# EAGLE design os20.newenc (EAGLE 6.4)
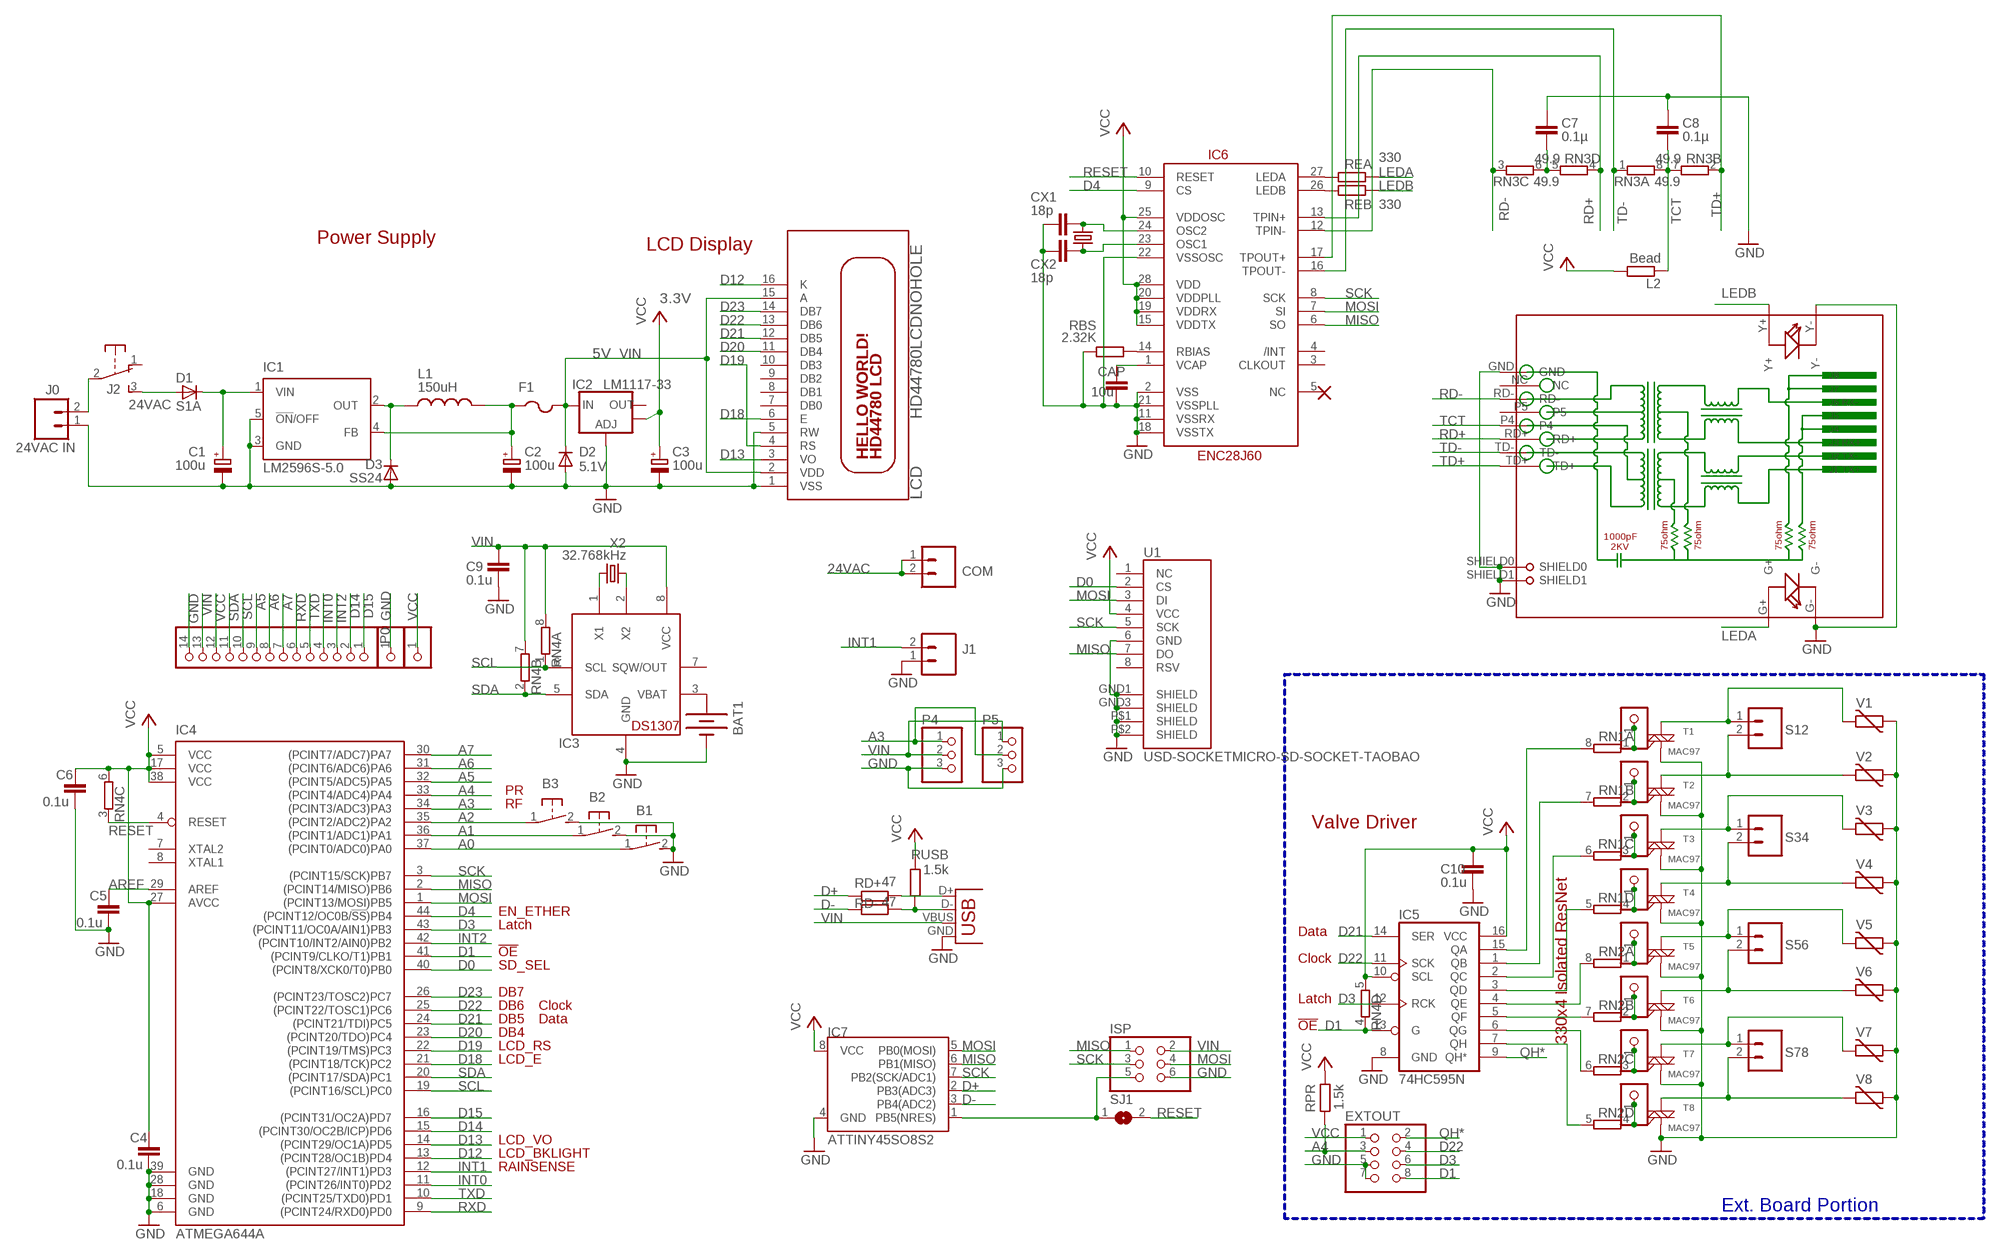
[diagram p0: schematic, sheet 1]

## Parts
B1  31-XX  [B3F-31XX]
B2  31-XX  [B3F-31XX]
B3  31-XX  [B3F-31XX]
BAT1  BATTERYBATTERY_12MM_SMT  [BATTCON_12MM_SMT]
C1  100u  CPOL-EUE3.5-8  [E3,5-8]
C2  100u  CPOL-EUD  [PANASONIC_D]
C3  100u  CPOL-EUD  [PANASONIC_D]
C4  0.1u  C-EUC0805  [C0805]
C5  0.1u  C-EUC0805  [C0805]
C6  0.1u  C-EUC0805  [C0805]
C7  0.1µ  C-EUC0805  [C0805]
C8  0.1µ  C-EUC0805  [C0805]
C9  0.1u  C-EUC0805  [C0805]
C10  0.1u  C-EUC0805  [C0805]
CAP  10u  C-EUC0805  [C0805]
COM  M025MM  [SCREWTERMINAL-5MM-2]
CX1  18p  C-EUC0805  [C0805]
CX2  18p  C-EUC0805  [C0805]
D1  S1A  DIODE-DO-214AC  [DO-214AC]
D2  5.1V  DIODE-MINIMELF  [MINIMELF]
D3  SS24  DIODE-DO-214AC  [DO-214AC]
EXTOUT  PINHD-2X4  [2X04]
F1  PTCFUSE-1812  [1812]
IC1  LM2596S-5.0  LM2596S  [TO263-5]
IC2  LM1117-33  V_REG_LM1117SOT223  [SOT223]
IC3  DS1307  DS1307SOIC  [SO08]
IC4  ATMEGA644A  [TQFP44]
IC5  74HC595N  74LS595D  [SO16]
IC6  ENC28J60  ENC28J60SO28LONG  [SOIC28WLONG]
IC7  ATTINY45SO8S2  [SO8S2]
ISP  PINHD-2X3  [2X03]
J0  24VAC IN  M025MM  [SCREWTERMINAL-5MM-2]
J1  M025MM  [SCREWTERMINAL-5MM-2]
J2  EG1206  [EG1206]
JP2  PINHD-1X1CB  [1X01-CLEANBIG]
JP3  PINHD-1X1CB  [1X01-CLEANBIG]
JP4  PINHD-1X1CB  [1X01-CLEANBIG]
JP5  PINHD-1X1CB  [1X01-CLEANBIG]
JP6  PINHD-1X1CB  [1X01-CLEANBIG]
JP7  PINHD-1X1CB  [1X01-CLEANBIG]
JP8  PINHD-1X1CB  [1X01-CLEANBIG]
JP9  PINHD-1X1CB  [1X01-CLEANBIG]
L1  150uH  INDUCTORPWR  [CDRH125]
L2  Bead  R-EU_R0805  [R0805]
LCD  HD44780LCDNOHOLE  [LCD1602A]
P0  PINHD-1X14-CB  [1X14-CB]
P1  PINHD-1X1CB  [1X01-CLEANBIG]
P2  PINHD-1X1CB  [1X01-CLEANBIG]
P4  PINHD-1X3  [1X03]
P5  PINHD-1X3  [1X03]
RBS  2.32K  R-EU_R0805  [R0805]
RD+  47  R-EU_R0805  [R0805]
RD-  47  R-EU_R0805  [R0805]
REA  330  R-EU_R0805  [R0805]
REB  330  R-EU_R0805  [R0805]
RJ45  HR911105A  [HR911105A]
RN1  4R-NEXB38V  [EXB38V]
RN2  4R-NEXB38V  [EXB38V]
RN3  49.9  4R-NEXB38V  [EXB38V]
RN4  4R-NEXB38V  [EXB38V]
RPR  1.5k  R-EU_R0805  [R0805]
RUSB  1.5k  R-EU_R0805  [R0805]
S12  M025MM  [SCREWTERMINAL-5MM-2]
S34  M025MM  [SCREWTERMINAL-5MM-2]
S56  M025MM  [SCREWTERMINAL-5MM-2]
S78  M025MM  [SCREWTERMINAL-5MM-2]
SJ1  SJ  [SJ]
T1  MAC97  MAC97SOT223  [SOT223]
T2  MAC97  MAC97SOT223  [SOT223]
T3  MAC97  MAC97SOT223  [SOT223]
T4  MAC97  MAC97SOT223  [SOT223]
T5  MAC97  MAC97SOT223  [SOT223]
T6  MAC97  MAC97SOT223  [SOT223]
T7  MAC97  MAC97SOT223  [SOT223]
T8  MAC97  MAC97SOT223  [SOT223]
U1  USD-SOCKETMICRO-SD-SOCKET-TAOBAO  [MICRO-SD-SOCKET-TAOBAO]
USB  USBPTH  [USB-B-PTH]
V1  MOV  VARISTOR-5  [R-5]
V2  MOV  VARISTOR-5  [R-5]
V3  MOV  VARISTOR-5  [R-5]
V4  MOV  VARISTOR-5  [R-5]
V5  MOV  VARISTOR-5  [R-5]
V6  MOV  VARISTOR-5  [R-5]
V7  MOV  VARISTOR-5  [R-5]
V8  MOV  VARISTOR-5  [R-5]
X1  25MHz  CRYSTALHC49US  [HC49US]
X2  32.768kHz  CRYSTALTC26H  [TC26H]

## Nets
24VAC [power]: COM.1 COM.2 D1.A J2.3(S)
A0: B1.1(P) IC4.37((PCINT0/ADC0)PA0)
A1: B2.1(P) IC4.36((PCINT1/ADC1)PA1)
A2: B3.1(P) IC4.35((PCINT2/ADC2)PA2)
A3: IC4.34((PCINT3/ADC3)PA3) P4.1 P5.2
A4: EXTOUT.3 IC4.33((PCINT4/ADC4)PA4) RPR.1
A5: IC4.32((PCINT5/ADC5)PA5) P0.9
A6: IC4.31((PCINT6/ADC6)PA6) P0.8
A7: IC4.30((PCINT7/ADC7)PA7) P0.7
AREF: C5.1 IC4.29(AREF)
D0: IC4.40((PCINT8/XCK0/T0)PB0) U1.2(CS)
D1: EXTOUT.8 IC4.41((PCINT9/CLKO/T1)PB1) IC5.13(G) RN4.4
D3: EXTOUT.6 IC4.43((PCINT11/OC0A/AIN1)PB3) IC5.12(RCK)
D4: IC4.44((PCINT12/OC0B/!SS!)PB4) IC6.9(CS)
D12: IC4.13((PCINT28/OC1B)PD4) LCD.16(K)
D13: IC4.14((PCINT29/OC1A)PD5) LCD.3(VO)
D14: IC4.15((PCINT30/OC2B/ICP)PD6) P0.2
D15: IC4.16((PCINT31/OC2A)PD7) P0.1
D18: IC4.21((PCINT18/TCK)PC2) LCD.6(E)
D19: IC4.22((PCINT19/TMS)PC3) LCD.4(RS)
D20: IC4.23((PCINT20/TDO)PC4) LCD.11(DB4)
D21: IC4.24((PCINT21/TDI)PC5) IC5.14(SER) LCD.12(DB5)
D22: EXTOUT.4 IC4.25((PCINT22/TOSC1)PC6) IC5.11(SCK) LCD.13(DB6)
D23: IC4.26((PCINT23/TOSC2)PC7) LCD.14(DB7)
D+: IC7.2(PB3(ADC3)) RD+.1
D-: IC7.3(PB4(ADC2)) RD-.1
GND: B1.2(S) B2.2(S) B3.2(S) BAT1.P$1(-) C1.- C2.- C3.- C4.2 C5.2 C6.2 C7.1 C8.1 C9.2 C10.2 CAP.2 CX1.2 CX2.2 D2.A D3.A EXTOUT.5 EXTOUT.7 IC1.3(GND) IC1.5(!ON!/OFF) IC2.1(ADJ) IC3.4(GND) IC4.6(GND) IC4.18(GND) IC4.28(GND) IC4.39(GND) IC5.8(GND) IC6.2(VSS) IC6.11(VSSRX) IC6.18(VSSTX) IC6.21(VSSPLL) IC6.22(VSSOSC) IC7.4(GND) ISP.6 J0.1 J1.1 LCD.1(VSS) LCD.5(RW) P0.14 P1.1 P4.3 P5.3 RBS.1 RJ45.G- RJ45.GND RJ45.SHIELD0 RJ45.SHIELD1 RJ45.Y- T1.1(M1) T2.1(M1) T3.1(M1) T4.1(M1) T5.1(M1) T6.1(M1) T7.1(M1) T8.1(M1) U1.6(GND) U1.GND1(SHIELD) U1.GND3(SHIELD) U1.P$1(SHIELD) U1.P$2(SHIELD) USB.GND V1.1 V2.1 V3.1 V4.1 V5.1 V6.1 V7.1 V8.1
INT0: IC4.11((PCINT26/INT0)PD2) P0.4
INT1: IC4.12((PCINT27/INT1)PD3) J1.2
INT2: IC4.42((PCINT10/INT2/AIN0)PB2) P0.3
LEDA: REA.2 RJ45.G+
LEDB: REB.2 RJ45.Y+
MISO: IC4.2((PCINT14/MISO)PB6) IC6.6(SO) IC7.6(PB1(MISO)) ISP.1 U1.7(DO)
MOSI: IC4.1((PCINT13/MOSI)PB5) IC6.7(SI) IC7.5(PB0(MOSI)) ISP.4 U1.3(DI)
N$1 [power]: C1.+ D1.C IC1.1(VIN)
N$2 [power]: C2.+ F1.1 IC1.4(FB) L1.2
N$3: JP2.1 RN1.1 T1.3(G)
N$4: IC5.5(QF) RN2.7
N$5: IC5.6(QG) RN2.6
N$6 [power]: J0.2 J2.2(P)
N$7: IC5.7(QH) RN2.5
N$8: IC3.1(X1) X2.2
N$9 [power]: D3.C IC1.2(OUT) L1.1
N$10: IC5.4(QE) RN2.8
N$11: IC5.3(QD) RN1.5
N$12: IC5.2(QC) RN1.6
N$13: IC5.1(QB) RN1.7
N$14: IC5.15(QA) RN1.8
N$15: JP3.1 RN1.2 T2.3(G)
N$16 [power]: S12.1 T1.4(M2) V1.2
N$17 [power]: S12.2 T2.4(M2) V2.2
N$18 [power]: S34.1 T3.4(M2) V3.2
N$19: JP4.1 RN1.3 T3.3(G)
N$20 [power]: S34.2 T4.4(M2) V4.2
N$21: JP5.1 RN1.4 T4.3(G)
N$22 [power]: S56.1 T5.4(M2) V5.2
N$23 [power]: S56.2 T6.4(M2) V6.2
N$24 [power]: S78.1 T7.4(M2) V7.2
N$25 [power]: S78.2 T8.4(M2) V8.2
N$26: JP6.1 RN2.1 T5.3(G)
N$27: JP7.1 RN2.2 T6.3(G)
N$28: JP8.1 RN2.3 T7.3(G)
N$29: JP9.1 RN2.4 T8.3(G)
N$30: IC3.2(X2) X2.1
N$34: IC6.27(LEDA) REA.1
N$36: BAT1.P$2(+) IC3.3(VBAT)
N$37: IC6.26(LEDB) REB.1
N$38: RD+.2 USB.D+
N$39: CAP.1 IC6.1(VCAP)
N$41: CX1.1 IC6.24(OSC2) X1.2
N$42: CX2.1 IC6.23(OSC1) X1.1
N$45: RD-.2 RUSB.1 USB.D-
N$52: IC7.1(PB5(NRES)) ISP.5 SJ1.1
N$54: C7.2 RN3.5 RN3.6
N$59: IC6.14(RBIAS) RBS.2
QH*: EXTOUT.2 IC5.9(QH*)
RD+: IC6.13(TPIN+) RJ45.RD+ RN3.4
RD-: IC6.12(TPIN-) RJ45.RD- RN3.3
RESET: IC4.4(RESET) IC6.10(RESET) RN4.3 SJ1.2
RXD: IC4.9((PCINT24/RXD0)PD0) P0.6
SCK: IC4.3((PCINT15/SCK)PB7) IC6.8(SCK) IC7.7(PB2(SCK/ADC1)) ISP.3 U1.5(SCK)
SCL: IC3.6(SCL) IC4.19((PCINT16/SCL)PC0) P0.10 RN4.1
SDA: IC3.5(SDA) IC4.20((PCINT17/SDA)PC1) P0.11 RN4.2
TCT: C8.2 L2.1 RJ45.P4 RN3.7 RN3.8
TD+: IC6.17(TPOUT+) RJ45.TD+ RN3.2
TD-: IC6.16(TPOUT-) RJ45.TD- RN3.1
TXD: IC4.10((PCINT25/TXD0)PD1) P0.5
VCC: C3.+ C4.1 C6.1 C10.1 EXTOUT.1 IC2.4(OUT) IC4.5(VCC) IC4.17(VCC) IC4.27(AVCC) IC4.38(VCC) IC5.10(SCL) IC5.16(VCC) IC6.15(VDDTX) IC6.19(VDDRX) IC6.20(VDDPLL) IC6.25(VDDOSC) IC6.28(VDD) IC7.8(VCC) L2.2 P0.12 P2.1 RN4.5 RN4.6 RPR.2 RUSB.2 U1.4(VCC)
VIN [power]: C9.1 D2.C F1.2 IC2.3(IN) IC3.8(VCC) ISP.2 LCD.2(VDD) LCD.15(A) P0.13 P4.2 P5.1 RN4.7 RN4.8 USB.VBUS
Unconnected: IC2.2(OUT) IC3.7(SQW/OUT) IC4.7(XTAL2) IC4.8(XTAL1) IC6.3(CLKOUT) IC6.4(/INT) IC6.5(NC) J2.1(O) LCD.7(DB0) LCD.8(DB1) LCD.9(DB2) LCD.10(DB3) RJ45.NC RJ45.P5 U1.1(NC) U1.8(RSV)

## Buses
B$1

## Notes on the sheet
- Power Supply
- LCD Display
- 3.3V
- 5V
- PR
- RF
- Valve Driver
- EN_ETHER
- Latch
- Data
- !OE
- Clock
- SD_SEL
- DB7
- Latch
- DB6 | Clock
- DB5 | Data
- !OE
- DB4
- 330x4 Isolated ResNet
- LCD_RS
- LCD_E
- LCD_VO
- LCD_BKLIGHT
- RAINSENSE
- Ext. Board Portion

## Library data of the parts
B1-B3 = adafruit:31-XX: OMRON SWITCH Now with beefier pads!
BAT1 = SparkFunNew:BATTERY: Battery Holders Various common sizes : AA, AAA, 20mm coin cell and 12mm coin cell.
C1-C3 = resistor:CPOL-EU: POLARIZED CAPACITOR, European symbol
C4-C6 C9 C10 = rcl:C-EU: CAPACITOR, European symbol
C7 C8 CAP CX1 CX2 = resistor:C-EU: CAPACITOR, European symbol
COM J0 J1 S12 S34 S56 S78 = SparkFun:M02: Header 2 Standard 2-pin 0.1" header. Use with straight break away headers (SKU : PRT-00116), right angle break away headers (PRT-00553), swiss pins (PRT-00743), machine pins (PRT-00117), and female headers (PRT-00115). Molex polarized connector foot print use with SKU : PRT-08233 with associated crimp pins and housings.
D1-D3 = diode:DIODE-: DIODE
EXTOUT = pinhead:PINHD-2X4: PIN HEADER
F1 = adafruit:PTCFUSE: PTC fuses, resettable thermistors
IC1 = national-semiconductor:LM2596: SIMPLE SWITCHER® Power Converter 150 kHz 3A Step-Down Voltage Regulator Source: http://www.national.com/ds/LM/LM2596.pdf; MF: NATIONAL SEMICONDUCTOR; MPN: LM2596S-ADJ/NOPB; OC_FARNELL: 9494367; OC_NEWARK: 41K3842
IC2 = SparkFun:V_REG_LM1117: Voltage Regulator LM1117 Standard adjustable voltage regulator but in SMD form. Spark Fun Electronics SKU : COM-00595
IC3 = adafruit:DS1307: DS1307 Real time clock (RTC) with battery backup ability. Talk to it via i2c
IC4 = atmel:ATMEGA644: 8-bit Microcontroller with 64K Bytes In-System Programmable Flash Source: http://www.atmel.com/dyn/resources/prod_documents/doc2593.pdf; MPN: ATMEGA644PV-10AU; OC_FARNELL: 1455123; OC_NEWARK: 58M3748
IC5 = SparkFun:74*595: 8-bit SHIFT REGISTER, output latch
IC6 = SparkFun:ENC28J60
IC7 = SparkFun:ATTINY45: Atmel ATTiny45
ISP = pinhead:PINHD-2X3: PIN HEADER
J2 = adafruit:EG1206
JP2-JP9 P1 P2 = adafruit:PINHD-1X1: Pin header 1x1 for 0.1" spacing With round pins
L1 = SparkFunNew:INDUCTOR: Inductors Basic Inductor/Choke - 0603 and 1206. Footprints are not proven and vary greatly between part numbers.
L2 RBS RD+ RD- REA REB RPR RUSB = rcl:R-EU_: RESISTOR, European symbol
LCD = adafruit:HD44780LCD: HD44780 LCD Standard character type LCDs, available in sizes from 8x1 to 40x4!
P0 = adafruit:PINHD-1X14: PIN HEADER
P4 P5 = pinhead:PINHD-1X3: PIN HEADER
RJ45 = CONNECTER:HR911105A
RN1-RN4 = resistor-dil:4R-N: Array Chip Resistor Source: RS Component / Phycomp; OC_FARNELL: unknown; OC_NEWARK: unknown
SJ1 = jumper:SJ: SMD solder JUMPER
T1-T8 = SparkFun:MAC97: MAC97 Triac http://www.onsemi.com/pub_link/Collateral/MAC97-D.PDF
U1 = SparkFunNew:USD-SOCKET: microSD Socket Push-push type uSD socket. Schematic element and footprint production proven. Spark Fun Electronics SKU : PRT-00127. tDoc lines correctly indicate media card edge positions when inserting (unlocked, locked, depressed).
USB = SparkFunNew:USB: USB Connectors USB-B-PTH is fully proven SKU : PRT-00139 USB-miniB is fully proven SKU : PRT-00587 USB-A-PCB is untested. USB-A-H is throughly reviewed, but untested. Spark Fun Electronics SKU : PRT-00437 USB-B-SMT is throughly reviewed, but untested. Needs silkscreen touching up. USB-A-S has not been used/tested USB-MB-H has not been used/tested
V1-V8 = varistor:VARISTOR: VARISTOR
X1 = SparkFun:CRYSTAL: Crystals Various standard crystals. Proven footprints. Spark Fun Electronics SKU : COM-00534
X2 = crystal:CRYSTAL: CRYSTAL; OC_FARNELL: unknown; OC_NEWARK: unknown

## Net classes
0 default: width 0.305 mm, clearance 0.203 mm
1 power: width 0.61 mm, clearance 0.203 mm

## Board
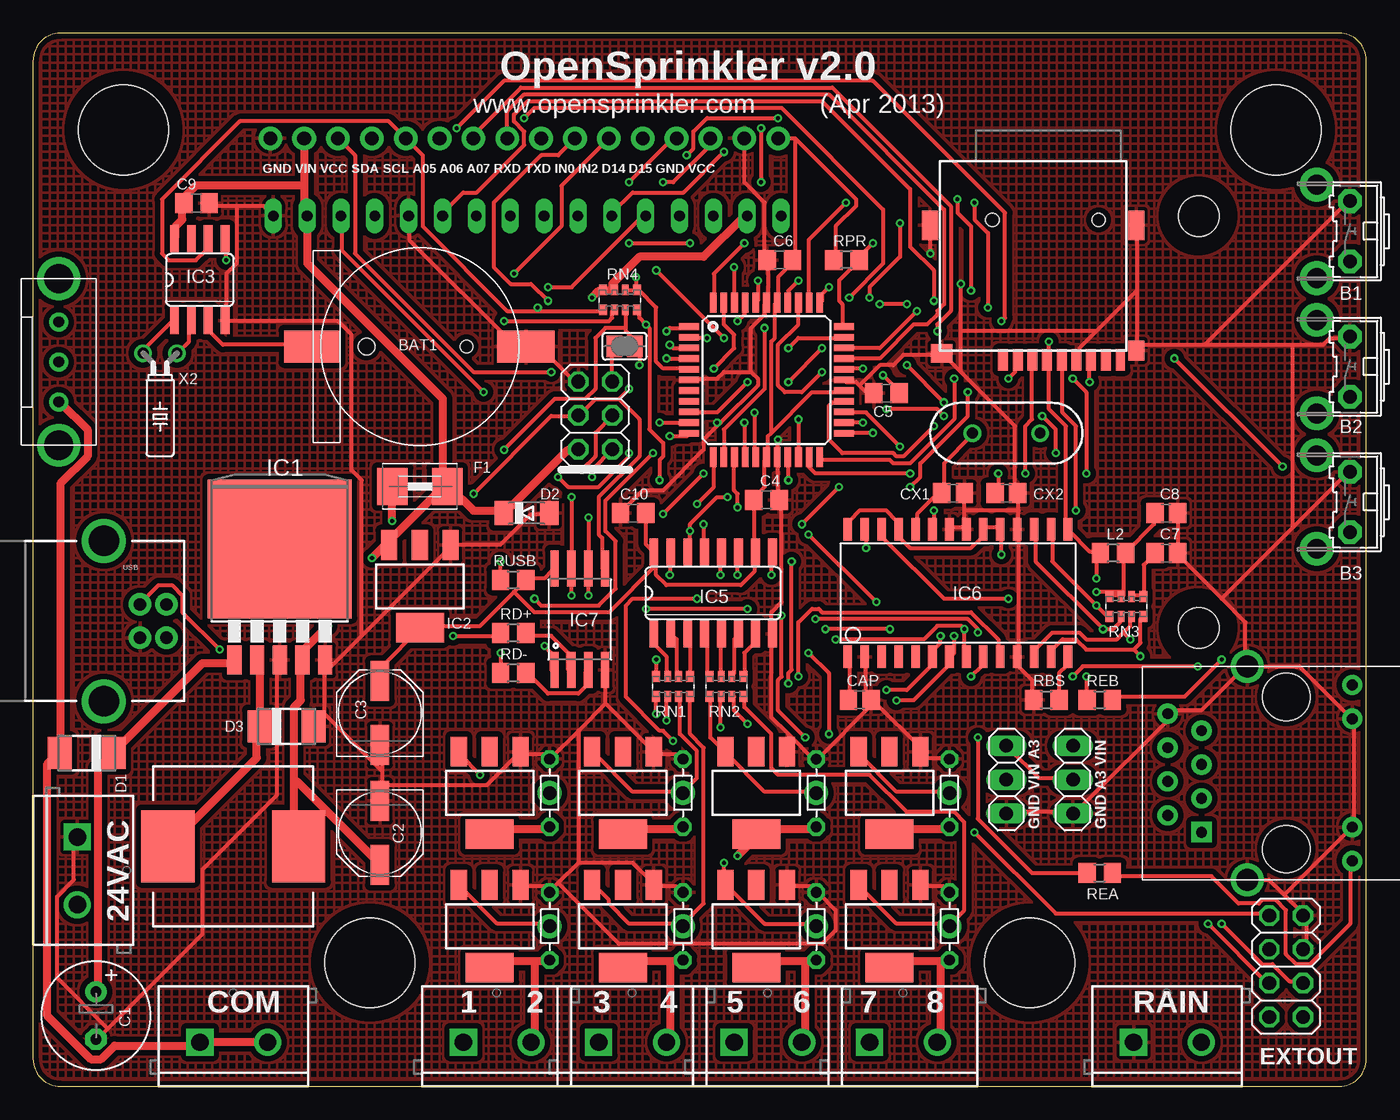
[diagram p1: board, top side]
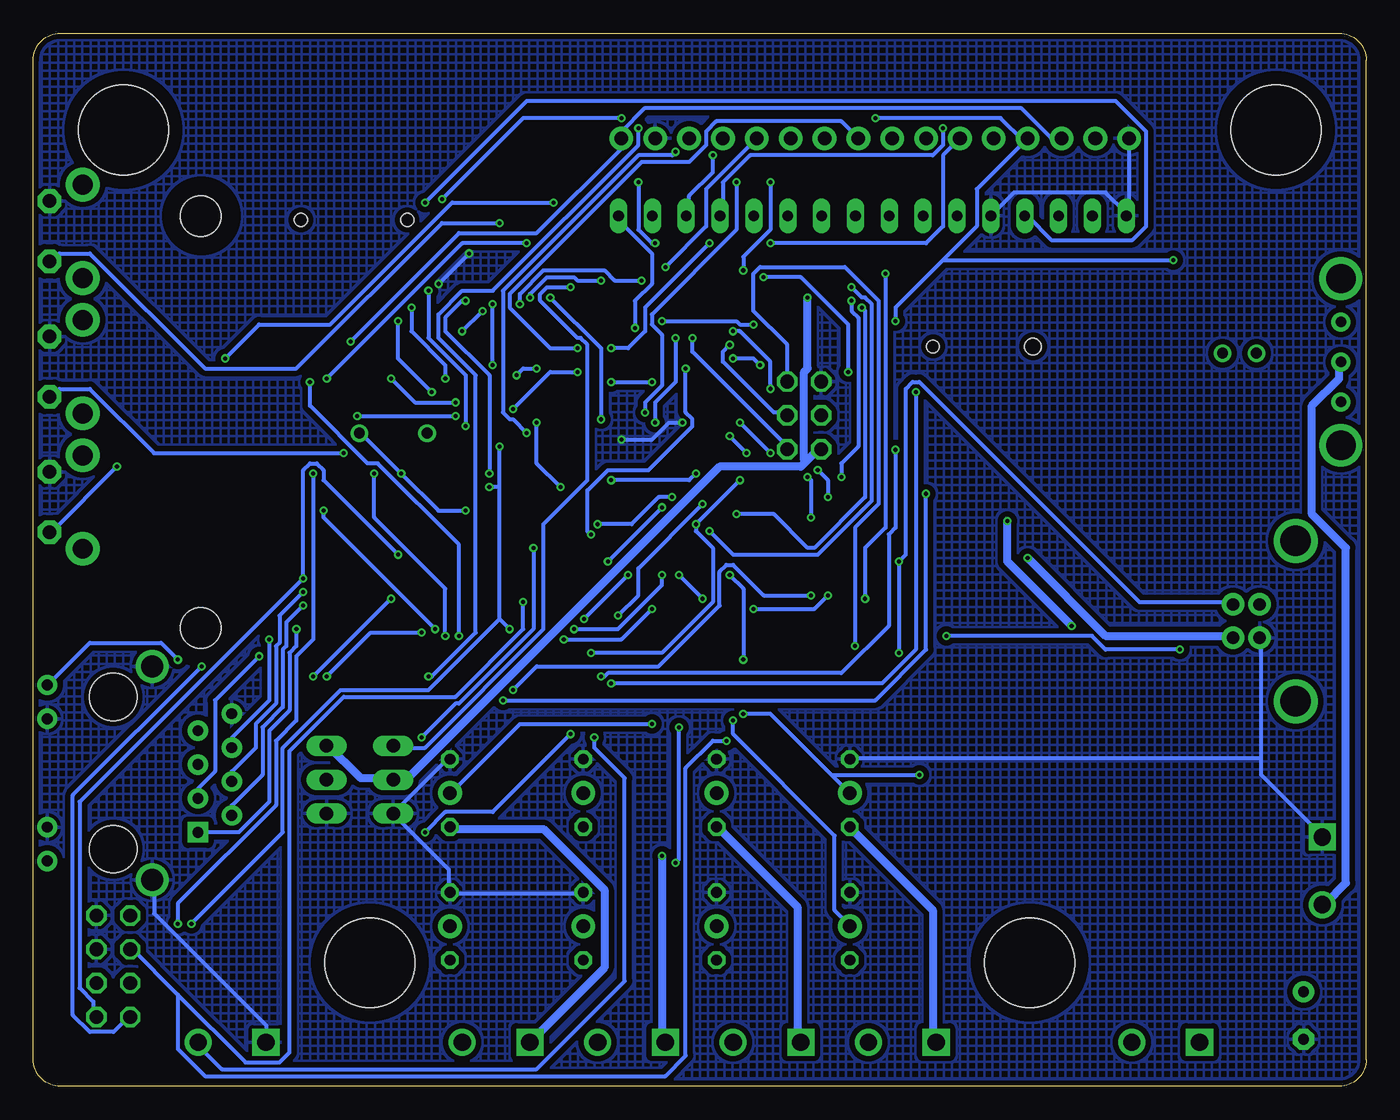
[diagram p2: board, bottom side, seen from below]

Size 100 x 79 mm. Coordinates in mm from the lower left corner, seen from the top.
Outline: 98,79 2,79 arc90 0,77 0,2 arc90 2,0 98,0 arc90 100,2 100,77 arc90 98,79
Copper layers (1*16): Top 0.035mm / dielectric 1.5mm / Bottom 0.035mm
Design rules "Fusion_eagle_rule_v1.1": minimum track width 6mil, minimum drill 12mil, track to track 6mil, track to pad 6mil, pad to pad 6mil, via to via 6mil, smd to smd 0mil, copper to edge 10mil, drill to drill 10mil, minimum pad ring 10mil, minimum via ring 6mil, stop-mask expansion 2mil, vias tented up to drill 100mil, thermal gap 10mil
Holes 3.05 mm at 87.46,65.3 87.46,34.38
Holes 6.75 mm at 6.76,71.74 93.24,71.74 25.26,9.26 74.74,9.26
tRestrict: area 84.9,31.8 to 89.9,36.9; area 84.9,62.8 to 89.9,67.8; area 2.8,67.7 to 10.8,75.7; area 89.2,67.7 to 97.2,75.7; area 21.3,5.3 to 29.3,13.3; area 70.7,5.3 to 78.7,13.3
bRestrict: area 2.8,67.7 to 10.8,75.7; area 89.2,67.7 to 97.2,75.7; area 21.3,5.3 to 29.3,13.3; area 70.7,5.3 to 78.7,13.3; area 84.9,62.8 to 89.9,67.8; area 84.9,31.8 to 89.9,36.9
vRestrict: area 32,73 to 71,78; area 17.3,68.3 to 57.1,69.3

### Footprints (pad centres in the part's own frame; a part is rotated, then mirrored left to right if it is on the bottom)
B3F-31XX = drill 1.016 pad 1.778 octagon: 1 -2.261,-1.245; 2 2.261,-1.245 | drill 1.499 pad 2.54: 3 -3.505,1.245; 4 3.505,1.245
BATTCON_12MM_SMT = smd 2.4 x 4.3: P$1 0,11.96 | smd 2.4 x 4.2: P$2 0,-4.1 | hole 0.95: 0,7.5 | hole 1.25: 0,0
E3,5-8 = drill 0.813 pad 1.6: + -1.778,0 | drill 0.813 pad 1.6 octagon: - 1.778,0
PANASONIC_D = smd 3 x 1.4: + 2.4,0; - -2.4,0
C0805 = smd 1.3 x 1.5: 1 -0.95,0; 2 0.95,0
C0805' = smd 1.3 x 1.5: 1 -0.85,0; 2 0.85,0
SCREWTERMINAL-5MM-2 = drill 1.3 pad 2.032 square: 1 0,0 | drill 1.3 pad 2.032: 2 5.08,0
DO-214AC = smd 1.8 x 2.4: A 2.025,0; C -2.025,0
MINIMELF = smd 1.4 x 1.8: A 1.7,0; C -1.7,0
2X04 = drill 1.016 octagon: 1 -3.81,-1.27; 2 -3.81,1.27; 3 -1.27,-1.27; 4 -1.27,1.27; 5 1.27,-1.27; 6 1.27,1.27; 7 3.81,-1.27; 8 3.81,1.27
1812 = smd 2.286 x 2.794: 1 -2.046,0; 2 2.046,0
TO263-5 = smd 1.067 x 2.159: 1 -3.404,-5.791; 2 -1.702,-5.791; 3 0,-5.791; 4 1.702,-5.791; 5 3.404,-5.791 | smd 10.8 x 10.41: 6 0,2.54
SOT223 = smd 1.219 x 2.235: 1 -2.311,-3.099; 2 0,-3.099; 3 2.311,-3.099 | smd 3.6 x 2.2: 4 0,3.099
SO08 = smd 0.66 x 2.032: 1 -1.905,-3.073; 2 -0.635,-3.073; 3 0.635,-3.073; 4 1.905,-3.073; 5 1.905,3.073; 6 0.635,3.073; 7 -0.635,3.073; 8 -1.905,3.073
TQFP44 = smd 1.5 x 0.5: 1 -5.8,4; 2 -5.8,3.2; 3 -5.8,2.4; 4 -5.8,1.6; 5 -5.8,0.8; 6 -5.8,0; 7 -5.8,-0.8; 8 -5.8,-1.6; 9 -5.8,-2.4; 10 -5.8,-3.2; 11 -5.8,-4; 23 5.8,-4; 24 5.8,-3.2; 25 5.8,-2.4; 26 5.8,-1.6; 27 5.8,-0.8; 28 5.8,0; 29 5.8,0.8; 30 5.8,1.6; 31 5.8,2.4; 32 5.8,3.2; 33 5.8,4 | smd 0.5 x 1.5: 12 -4,-5.8; 13 -3.2,-5.8; 14 -2.4,-5.8; 15 -1.6,-5.8; 16 -0.8,-5.8; 17 0,-5.8; 18 0.8,-5.8; 19 1.6,-5.8; 20 2.4,-5.8; 21 3.2,-5.8; 22 4,-5.8; 34 4,5.8; 35 3.2,5.8; 36 2.4,5.8; 37 1.6,5.8; 38 0.8,5.8; 39 0,5.8; 40 -0.8,5.8; 41 -1.6,5.8; 42 -2.4,5.8; 43 -3.2,5.8; 44 -4,5.8
SO16 = smd 0.66 x 2.032: 1 -4.445,-3.073; 2 -3.175,-3.073; 3 -1.905,-3.073; 4 -0.635,-3.073; 5 0.635,-3.073; 6 1.905,-3.073; 7 3.175,-3.073; 8 4.445,-3.073; 9 4.445,3.073; 10 3.175,3.073; 11 1.905,3.073; 12 0.635,3.073; 13 -0.635,3.073; 14 -1.905,3.073; 15 -3.175,3.073; 16 -4.445,3.073
SOIC28WLONG = smd 0.65 x 1.7: 1 -8.89,-4.78; 2 -7.62,-4.78; 3 -6.35,-4.78; 4 -5.08,-4.78; 5 -3.81,-4.78; 6 -2.54,-4.78; 7 -1.27,-4.78; 8 0,-4.78; 9 1.27,-4.78; 10 2.54,-4.78; 11 3.81,-4.78; 12 5.08,-4.78; 13 6.35,-4.78; 14 7.62,-4.78; 15 7.62,4.78; 16 6.35,4.78; 17 5.08,4.78; 18 3.81,4.78; 19 2.54,4.78; 20 1.27,4.78; 21 0,4.78; 22 -1.27,4.78; 23 -2.54,4.78; 24 -3.81,4.78; 25 -5.08,4.78; 26 -6.35,4.78; 27 -7.62,4.78; 28 -8.89,4.78
SO8S2 = smd 0.61 x 2.7: 1 -1.905,-3.778; 2 -0.635,-3.778; 3 0.635,-3.778; 4 1.905,-3.778; 5 1.905,3.853; 6 0.635,3.853; 7 -0.635,3.853; 8 -1.905,3.853
2X03 = drill 1.016 octagon: 1 -2.54,-1.27; 2 -2.54,1.27; 3 0,-1.27; 4 0,1.27; 5 2.54,-1.27; 6 2.54,1.27
EG1206 = drill 0.8 pad 1.422: 1 -3,0; 2 0,0; 3 3,0 | drill 2.2: MT1 -6.25,0; MT2 6.25,0
1X01-CLEANBIG = drill 1.016 pad 1.778: 1 0,0
CDRH125 = smd 5.4 x 4: 1 0,4.9; 2 0,-4.9
R0805 = smd 1.3 x 1.5: 1 -0.95,0; 2 0.95,0
LCD1602A = drill 0.8 long: 1 8,33.46; 2 10.54,33.46; 3 13.08,33.46; 4 15.62,33.46; 5 18.16,33.46; 6 20.7,33.46; 7 23.24,33.46; 8 25.78,33.46; 9 28.32,33.46; 10 30.86,33.46; 11 33.4,33.46; 12 35.94,33.46; 13 38.48,33.46; 14 41.02,33.46; 15 43.56,33.46; 16 46.1,33.46
1X14-CB = drill 1.016 pad 1.778: 1 -16.51,0; 2 -13.97,0; 3 -11.43,0; 4 -8.89,0; 5 -6.35,0; 6 -3.81,0; 7 -1.27,0; 8 1.27,0; 9 3.81,0; 10 6.35,0; 11 8.89,0; 12 11.43,0; 13 13.97,0; 14 16.51,0
1X03 = drill 1.016 long: 1 -2.54,0; 2 0,0; 3 2.54,0
HR911105A = drill 0.813 pad 1.524: G+ 4.953,-6.604; G- 4.953,-4.064; GND -8.89,4.445; NC -6.35,3.175; P4 -8.89,-0.635; P5 -6.35,0.635; RD+ -6.35,-1.905; RD- -8.89,1.905; TD- -8.89,-3.175; Y+ 4.953,6.604; Y- 4.953,4.064 | drill 1.651 pad 2.159: SHIELD0 -2.921,8.001; SHIELD1 -2.921,-8.001 | drill 0.813 pad 1.524 square: TD+ -6.35,-4.445 | hole 3.556: 0,-5.715; 0,5.715
EXB38V = smd 0.6 x 0.8: 1 -1.275,-0.75; 4 1.275,-0.75; 5 1.275,0.75; 8 -1.275,0.75 | smd 0.5 x 0.8: 2 -0.4,-0.75; 3 0.4,-0.75; 6 0.4,0.75; 7 -0.4,0.75
SJ = smd 1.168 x 1.6: 1 -0.762,0; 2 0.762,0
MICRO-SD-SOCKET-TAOBAO = smd 0.75 x 1.6: 1 2.25,10.5; 2 1.15,10.5; 3 0.05,10.5; 4 -1.05,10.5; 5 -2.15,10.5; 6 -3.25,10.5; 7 -4.35,10.5; 8 -5.45,10.5 | smd 0.7 x 1.6: CD -6.55,10.5 | smd 1.2 x 1.5: GND1 -7.75,9.8 | smd 1.6 x 1.4: GND3 6.85,10 | smd 1.2 x 2.2: P$1 7.75,0.4; P$2 -7.75,0.4 | hole 1: 3.05,0; -4.93,0
USB-B-PTH = drill 0.914 pad 1.676: D+ 0,1.25; D- 1.981,1.25; GND 0,-1.25; VBUS 1.981,-1.25 | drill 2.286: S1 -2.718,-6.02; S2 -2.718,6.02
R-5 = drill 0.813 octagon: 1 -2.54,0; 2 2.54,0
HC49US = drill 0.813: 1 -2.54,0; 2 2.54,0
TC26H = drill 0.813: 1 -1.27,0; 2 1.27,0

### Placement (x,y rotation side)
B1  97.54,64.15 90 top
B2  97.54,53.99 90 top
B3  97.54,43.83 90 top
BAT1  25,55.5 270 top
C1  4.7,5.3 270 top
C2  26,19 270 top
C3  26,28 90 top
C4  55,44 0 top
C5  64,52 180 top
C6  56,62 180 top
C7  0.1µ  [C0805']  85,40 180 top
C8  0.1µ  [C0805']  85,43 180 top
C9  12.24,66.25 0 top
C10  45,43 180 top
CAP  10u  [C0805']  62,29 0 top
COM  12.5,3.3 0 top
CX1  18p  [C0805']  69,44.5 0 top
CX2  18p  [C0805']  73,44.5 0 top
D1  4,25 180 top
D2  37,43 0 top
D3  19,27 0 top
EXTOUT  94,9 90 top
F1  29,45 0 top
IC1  18.49,37.76 0 top
IC2  29,37.5 180 top
IC3  12.49,60.51 0 top
IC4  55,53 0 top
IC5  51,37 0 top
IC6  70,37 0 top
IC7  41,35 0 top
ISP  42.16,50.33 90 top
J0  3.3,18.7 270 top
J1  82.55,3.3 0 top
J2  1.9,54.34 270 top
JP2  38.74,22 0 top
JP3  38.74,12 0 top
JP4  48.74,22 0 top
JP5  48.74,12 0 top
JP6  58.74,22 0 top
JP7  58.74,12 0 top
JP8  68.74,22 0 top
JP9  68.74,12 0 top
L1  15,18 90 top
L2  81,40 180 top
LCD  10,31.84 0 top
P0  34.29,71.12 180 top
P1  53.34,71.12 0 top
P2  55.88,71.12 0 top
P4  73,23 270 top
P5  78,23 270 top
RBS  76,29 0 top
RD+  36,34 180 top
RD-  36,31 180 top
REA  80,16 0 top
REB  80,29 0 top
RJ45  94,23.5 0 top
RN1  48,30 0 top
RN2  52,30 0 top
RN3  82,36 0 top
RN4  44,59 0 top
RPR  61,62 180 top
RUSB  36,38 0 top
S12  32.26,3.3 0 top
S34  42.42,3.3 0 top
S56  52.58,3.3 0 top
S78  62.74,3.3 0 top
SJ1  44.36,55.52 0 top
T1  34.24,22 180 top
T2  34.24,12 180 top
T3  44.24,22 180 top
T4  44.24,12 180 top
T5  54.24,22 180 top
T6  54.24,12 180 top
T7  64.24,22 180 top
T8  64.24,12 180 top
U1  75,65 180 top
USB  8,34.9 0 top
V1  38.74,22 270 top
V2  38.74,12 270 top
V3  48.74,22 270 top
V4  48.74,12 270 top
V5  58.74,22 270 top
V6  58.74,12 270 top
V7  68.74,22 270 top
V8  68.74,12 270 top
X1  73,49 180 top
X2  9.51,55 180 top

### Tracks (layer width: path | path; a pad name or v marks a point on that pad's centre or on a via)
24VAC
  Top 0.61: COM.2 17.53,3.3 12.7,3.3 COM.1 12.45,3.05 6.1,3.05 5.08,2.03 4.32,2.03 1.02,5.33 1.02,24.13 1.78,24.89 D1.A 2.03,25.15 2.03,45.21 4.06,47.24 4.06,49.28 2.03,51.31 J2.3
A0  (via drill 0.3)
  Top 0.305: v57.4,60.45 56.64,59.69 56.64,58.93 IC4.37 | v62.74,59.18 62.74,59.94 65.02,62.23 v65.02,64.77
  Bottom 0.305: v57.4,60.45 59.18,60.45 59.44,60.71 61.47,60.71 62.74,59.44 v62.74,59.18 | v65.02,64.77 69.34,64.77 80.26,53.85 87.12,53.85 95.76,62.48 98.04,62.48 98.55,61.98 B1.1
A1  (via drill 0.3)
  Top 0.305: v59.18,53.59 57.66,52.07 56.39,52.07 55.88,52.58 55.88,55.63 57.4,57.15 57.4,58.67 IC4.36 | v64.01,50.8 67.82,50.8 v68.33,50.29 | v75.69,50.29 76.71,49.28 v76.71,47.5
  Bottom 0.305: v59.18,53.59 61.21,53.59 v64.01,50.8 | v75.69,50.29 v68.33,50.29 | v76.71,47.5 90.93,47.5 95.76,52.32 98.04,52.32 98.55,51.82 B2.1
A2  (via drill 0.3)
  Top 0.305: v60.96,66.29 58.17,63.5 58.17,58.93 IC4.35 | v93.73,46.48 v85.6,54.61
  Bottom 0.305: v60.96,66.29 68.58,66.29 77.72,57.15 83.06,57.15 v85.6,54.61 | v93.73,46.48 98.55,41.66 B3.1
A3  (via drill 0.3)
  Top 0.305: v59.69,59.94 59.18,59.44 59.18,58.93 IC4.34 | P5.2 77.98,23.11 75.44,23.11 73.15,25.4 P4.1
  Bottom 0.305: v59.69,59.94 61.47,59.94 61.98,59.44 61.98,58.93 59.18,56.13 58.93,56.13 58.42,55.63 58.42,45.47 61.72,42.16 61.72,34.29 70.61,25.4 72.9,25.4 P4.1
A4  (via drill 0.3)
  Top 0.305: IC4.33 60.71,57.15 60.71,58.67 60.45,58.93 60.45,60.45 61.98,61.98 RPR.1 61.98,62.23 v62.99,63.25 | v89.15,12.19 92.2,9.14 92.96,9.14 94.23,7.87 95.25,7.87 EXTOUT.3 | v78.99,45.97 78.99,52.07 v77.98,53.09
  Bottom 0.305: v89.15,12.19 89.15,13.72 81.79,21.08 81.79,25.91 80.26,27.43 80.26,32.26 78.99,33.53 v78.99,45.97 | v77.98,53.09 67.82,63.25 v62.99,63.25
A5  (via drill 0.3)
  Top 0.305: v56.64,55.37 57.4,56.13 60.71,56.13 IC4.32 | v44.7,63.25 v49.28,63.25
  Bottom 0.305: v56.64,55.37 55.37,55.37 54.1,56.64 54.1,58.42 v49.28,63.25 | v44.7,63.25 33.02,63.25 31.75,64.52 31.75,69.85 P0.9
A6  (via drill 0.3)
  Top 0.305: v66.29,58.17 63.5,55.37 60.96,55.37 IC4.31 | v67.82,56.64 67.82,57.15 68.83,58.17 68.83,66.04 59.94,74.93 36.58,74.93 33.02,71.37 P0.8
  Bottom 0.305: v67.82,56.64 v66.29,58.17
A7
  Top 0.305: P0.7 35.56,73.15 36.83,74.42 59.69,74.42 68.33,65.79 68.33,58.67 67.82,58.17 67.82,57.91 67.06,57.15 66.04,57.15 63.5,54.61 60.96,54.61 IC4.30
AREF  (via drill 0.3)
  Top 0.305: v62.23,53.85 60.96,53.85 IC4.29 | v63.75,53.34 65.02,52.07 C5.1
  Bottom 0.305: v62.23,53.85 63.25,53.85 v63.75,53.34
D0  (via drill 0.3)
  Top 0.305: v54.36,60.45 54.36,58.93 IC4.40 | v65.53,58.67 v63.5,58.67 | v68.33,51.31 v65.53,54.1 | v73.15,53.09 73.66,53.59 73.66,54.36 U1.2
  Bottom 0.305: v54.36,60.45 56.39,60.45 57.15,61.21 61.72,61.21 63.5,59.44 v63.5,58.67 | v65.53,54.1 v65.53,58.67 | v68.33,51.31 71.37,51.31 v73.15,53.09
D1  (via drill 0.3)
  Top 0.305: v52.83,57.4 53.34,57.91 53.34,58.67 IC4.41 | RN4.4 45.47,58.17 45.47,57.66 v45.97,57.15 46.23,56.9 46.23,49.28 47.24,48.26 47.24,47.24 46.99,46.99 v46.99,45.47 | v50.29,42.16 50.29,40.13 IC5.13 | v70.61,19.05 76.71,12.95 92.71,12.95 EXTOUT.8 | v59.69,26.42 59.69,30.99 v58.17,32.51
  Bottom 0.305: v45.97,57.15 46.99,57.15 47.24,57.4 v52.83,57.4 | v46.99,45.47 v50.29,42.16 50.29,41.66 49.02,40.39 49.02,36.32 52.83,32.51 v58.17,32.51 | v70.61,19.05 69.09,20.57 65.53,20.57 v59.69,26.42
D3  (via drill 0.3)
  Top 0.305: v51.05,53.85 52.58,55.37 52.58,56.39 51.82,57.15 51.82,58.67 IC4.43 | v63.25,36.32 v58.17,41.4 | v51.56,38.35 51.56,39.88 IC5.12 | v49.78,36.58 44.96,36.58 44.45,36.07 44.45,29.21 46.99,26.67 47.24,26.67 v48.01,25.91
  Bottom 0.305: v51.05,53.85 51.05,50.55 50.55,50.04 50.55,49.53 53.85,46.23 56.9,46.23 58.42,44.7 58.42,41.66 v58.17,41.4 | v63.25,36.32 63.25,34.29 68.33,29.21 76.71,29.21 80.77,25.15 80.77,2.54 81.53,1.78 84.07,1.78 89.15,6.86 | 89.15,6.86 92.71,10.41 EXTOUT.6 | v49.78,36.58 v51.56,38.35 | v48.01,25.91 49.02,25.91 51.05,23.88 51.05,2.29 52.58,0.76 87.12,0.76 89.15,2.79 89.15,6.86
D4  (via drill 0.3)
  Top 0.305: v53.34,63.25 51.05,60.96 51.05,58.93 IC4.44 | v54.61,71.88 v54.61,67.82 | v70.36,30.73 71.12,31.5 71.12,32 IC6.9
  Bottom 0.305: v53.34,63.25 53.59,63.25 54.61,64.26 v54.61,67.82 | v54.61,71.88 54.61,70.61 65.53,59.69 67.82,59.69 69.6,57.91 69.6,56.13 66.8,53.34 66.8,34.04 70.1,30.73 v70.36,30.73
D12  (via drill 0.3)
  Top 0.305: v54.86,56.9 54.86,52.32 51.82,49.28 51.82,47.24 IC4.13
  Bottom 0.305: v54.86,56.9 54.86,58.93 53.59,60.2 53.59,62.48 55.88,64.77 55.88,65.28 LCD.16
D13  (via drill 0.3)
  Top 0.305: v52.83,43.43 52.83,44.45 52.58,44.7 52.58,46.99 IC4.14 | v56.9,39.37 56.9,31.24 56.64,30.99 v56.64,30.23 | v33.78,52.07 23.11,62.74 23.11,65.28 LCD.3
  Bottom 0.305: v56.9,39.37 v52.83,43.43 | v56.64,30.23 36.32,30.23 33.78,32.77 v33.78,52.07
D14  (via drill 0.3)
  Top 0.305: v53.34,49.78 53.34,47.24 IC4.15 | v46.74,61.21 v51.82,56.13 | v44.7,67.82 48.01,71.12 P0.2
  Bottom 0.305: v53.34,49.78 53.34,51.31 51.82,52.83 v51.82,56.13 | v46.74,61.21 46.74,62.23 44.7,64.26 v44.7,67.82
D15  (via drill 0.3)
  Top 0.305: v54.1,50.55 54.1,47.24 IC4.16 | v47.24,67.82 48.01,67.82 50.8,70.61 P0.1
  Bottom 0.305: v54.1,50.55 54.1,51.31 52.83,52.58 52.83,56.39 53.59,57.15 53.59,57.91 47.24,64.26 v47.24,67.82
D18  (via drill 0.3)
  Top 0.305: v65.79,45.97 58.67,45.97 58.17,46.48 58.17,46.99 IC4.21 | v67.56,58.93 67.56,61.21 65.79,62.99 65.79,67.31 59.18,73.91 37.08,73.91 36.07,72.9 36.07,72.39 36.83,71.63 36.83,70.61 33.27,67.06 32.26,67.06 30.73,65.53 LCD.6
  Bottom 0.305: v65.79,45.97 65.79,53.34 69.09,56.64 69.09,57.66 67.82,58.93 v67.56,58.93
D19  (via drill 0.3)
  Top 0.305: v69.09,53.09 69.09,50.04 65.79,46.74 64.52,46.74 64.26,46.99 59.18,46.99 IC4.22 | v71.63,58.42 71.63,64.01 70.61,65.02 v70.61,66.29
  Bottom 0.305: v69.09,53.09 69.09,54.1 71.63,56.64 v71.63,58.42 | v70.61,66.29 62.99,73.91 18.8,73.91 16.51,71.63 16.51,64.52 17.53,63.5 23.62,63.5 25.4,65.28 LCD.4
D20  (via drill 0.3)
  Top 0.305: v62.99,49.02 60.96,49.02 IC4.23 | v51.82,70.1 48.77,67.06 44.96,67.06 43.43,65.53 LCD.11
  Bottom 0.305: v62.99,49.02 64.01,50.04 64.26,50.04 64.77,50.55 64.77,59.69 54.61,69.85 52.07,69.85 v51.82,70.1
D21  (via drill 0.3)
  Top 0.305: v62.23,49.78 60.96,49.78 IC4.24 | v57.66,42.16 v60.45,44.96 | v52.07,44.2 51.31,44.2 49.28,42.16 v49.28,41.66 49.28,40.13 IC5.14 | v38.61,59.94 40.39,59.94 45.72,65.28 LCD.12
  Bottom 0.305: v62.23,49.78 62.23,46.74 v60.45,44.96 | v57.66,42.16 55.12,42.16 53.09,44.2 v52.07,44.2 | v38.61,59.94 37.85,59.18 37.59,59.18 37.08,58.67 37.08,43.94 41.15,39.88 47.5,39.88 v49.28,41.66
D22  (via drill 0.3)
  Top 0.305: v65.02,48.01 62.48,50.55 60.96,50.55 IC4.25 | v88.14,12.19 92.71,7.62 EXTOUT.4 | v52.83,38.35 52.83,39.88 IC5.11 | v64.26,34.29 v59.44,34.29 | v31.75,71.88 35.31,75.44 62.99,75.44 72.9,65.53 72.9,57.66 v72.64,57.4 | v70.1,52.07 70.1,50.29 66.55,46.74 66.55,45.72 v65.79,44.96
  Bottom 0.305: 65.02,35.05 65.02,44.96 | 65.02,44.96 v65.02,48.01 | 65.02,35.05 70.36,29.72 76.96,29.72 81.28,25.4 81.28,19.05 v88.14,12.19 | v52.83,38.35 52.83,37.59 56.13,34.29 v59.44,34.29 | 65.02,35.05 v64.26,34.29 | v31.75,71.88 31.75,70.61 32.51,69.85 46.23,69.85 48.26,67.82 48.26,65.53 LCD.13 | v72.64,57.4 72.64,54.61 v70.1,52.07 | 65.02,44.96 v65.79,44.96
D23  (via drill 0.3)
  Top 0.305: v67.56,49.53 65.28,47.24 64.77,47.24 64.52,47.5 60.71,47.5 59.69,48.51 59.69,51.05 59.94,51.31 60.71,51.31 IC4.26 | v70.36,59.69 70.36,64.52 69.34,65.53 v69.34,66.55 | v55.88,72.64 50.55,72.64 49.53,71.63 49.53,70.36 v49.02,69.85
  Bottom 0.305: v67.56,49.53 67.56,53.34 70.36,56.13 v70.36,59.69 | v69.34,66.55 63.25,72.64 v55.88,72.64 | v49.02,69.85 49.02,68.58 50.8,66.8 50.8,65.53 LCD.14
D+
  Top 0.305: RD+.1 37.08,33.78 38.86,33.78 40.13,32.51 40.13,31.24 IC7.2
D-
  Top 0.305: RD-.1 37.08,30.99 38.61,29.46 40.89,29.46 41.4,29.97 41.4,30.99 IC7.3
GND  (via drill 0.3)
  Top 0.305: 5.59,4.32 4.83,3.56 C1.- | 5.59,4.32 12.7,11.43 12.7,16.26 18.29,21.84 18.29,31.75 IC1.3 | 5.59,4.32 1.78,8.13 1.78,14.22 3.05,15.49 3.05,18.54 J0.1 | ISP.6 40.89,53.09 40.39,53.09 38.1,55.37 37.08,55.37 BAT1.P$1 36.83,55.63 36.07,55.63 28.19,63.5 28.19,65.28 LCD.5 | 15.24,66.04 17.27,66.04 17.78,65.53 LCD.1 | 15.24,66.04 13.21,66.04 C9.2 | 15.24,66.04 15.24,61.72 14.48,60.96 14.48,57.66 IC3.4 14.48,57.4 22.86,57.4 23.88,56.39 23.88,46.23 24.64,45.47 24.64,33.78 | T2.1 36.58,14.99 38.35,14.99 38.61,14.73 V2.1 38.86,14.73 39.37,15.24 | V4.1 48.51,14.73 48.26,14.99 46.74,14.99 T4.1 46.48,15.24 44.96,16.76 40.89,16.76 | 40.89,16.76 39.37,15.24 | V3.1 48.51,24.64 48.26,24.89 46.74,24.89 T3.1 46.48,25.15 42.93,28.7 | 42.93,28.7 42.93,30.99 IC7.4 | 42.93,28.7 40.89,26.67 | 40.89,26.67 38.86,24.64 V1.1 38.61,24.64 38.35,24.89 36.58,24.89 T1.1 36.32,24.89 34.04,22.61 26.16,22.61 | 40.89,26.67 40.89,16.76 | D2.A 38.61,42.93 37.34,42.93 35.05,40.64 31.5,40.64 IC2.1 31.24,40.39 24.64,33.78 | 21.84,27.94 21.84,30.99 | 21.84,30.99 21.84,31.75 IC1.5 21.84,30.99 | 21.84,27.94 21.08,27.18 D3.A 21.84,27.94 | 26.16,23.62 26.16,25.4 C3.- | 26.16,23.62 26.16,22.61 | 26.16,22.61 26.16,21.59 C2.- 26.16,22.61 | 26.16,23.62 21.84,27.94 | 21.84,30.99 24.64,33.78 | 51.56,49.78 54.36,52.58 54.36,53.09 53.85,53.59 | 51.56,49.78 50.29,48.51 50.29,47.75 47.24,44.7 45.72,44.7 44.2,43.18 C10.2 | 53.85,53.59 51.82,53.59 51.31,53.09 49.28,53.09 IC4.6 | 53.85,53.59 53.85,56.9 54.86,57.91 54.86,58.67 IC4.39 55.12,58.93 55.12,61.98 C6.2 54.86,62.23 54.86,66.29 53.34,67.82 P1.1 | 56.64,26.42 58.67,24.38 V5.1 58.93,24.64 62.74,28.45 62.74,28.96 CAP.2
  Top 0.305: 56.64,26.42 55.37,27.69 55.37,33.78 IC5.8 55.37,34.04 55.37,35.56 56.13,36.32 56.13,43.94 C4.2 55.88,44.2 55.88,46.99 IC4.18 55.88,47.24 v55.88,48.51 | 56.64,26.42 56.64,25.15 T5.1 | T6.1 56.64,14.99 58.42,14.99 58.67,14.73 V6.1 58.93,14.48 60.2,13.21 60.2,11.68 59.18,10.67 43.94,10.67 39.37,15.24 | T8.1 66.8,14.99 68.33,14.99 68.58,14.73 V8.1 | P4.3 73.15,20.57 77.98,20.57 P5.3 78.23,20.57 85.85,28.19 | CAP.2 62.99,28.96 66.8,25.15 T7.1 66.8,24.89 67.06,24.64 68.58,24.64 V7.1 | IC6.2 62.48,32 62.48,29.46 62.74,29.21 CAP.2 | v51.31,49.78 51.56,49.78 | RBS.1 74.93,29.21 74.93,30.48 73.91,31.5 73.91,32 IC6.11 73.91,32.26 73.91,41.66 IC6.18 73.91,41.91 73.91,43.18 | 69.85,41.91 69.85,43.18 | 69.85,43.18 CX1.2 | 69.85,41.91 68.83,41.91 IC6.22 | 69.85,41.91 IC6.21 | 61.98,52.58 61.72,52.83 60.96,52.83 IC4.28 | 61.98,52.58 62.48,52.07 62.99,52.07 C5.2 | 73.91,43.18 73.91,44.45 CX2.2 73.66,44.7 73.66,49.53 69.6,53.59 | 69.6,53.59 68.33,54.86 U1.GND3 68.07,54.86 65.28,54.86 64.52,54.1 63.5,54.1 61.98,52.58 | v67.31,62.48 67.31,64.52 U1.P$1 | 69.6,53.59 69.6,56.64 | 69.6,56.64 v69.6,60.2 | 73.91,43.18 69.85,43.18 | EXTOUT.5 95.5,10.41 95.5,12.7 EXTOUT.7 95.25,12.95 93.73,14.48 | 93.73,14.48 92.71,15.49 91.19,15.49 RJ45.SHIELD1 | 93.73,14.48 93.98,14.48 98.81,19.3 RJ45.G- 99.06,19.56 99.06,27.43 RJ45.Y- 98.81,27.69 95,31.5 91.19,31.5 RJ45.SHIELD0 | 82.8,59.69 82.8,64.52 U1.P$2 | 82.8,59.69 82.8,55.63 | 82.8,55.63 82.8,55.37 U1.GND1 82.8,55.63 | 82.8,59.69 79.76,56.64 | 79.76,56.64 78.49,55.37 78.49,54.61 U1.6 | 82.8,55.63 87.88,55.63 | 87.88,55.63 94.49,55.63 | 94.49,55.63 96.77,55.63 97.28,56.13 98.55,56.13 B2.2
  Top 0.305: 87.88,55.63 98.55,66.29 B1.2 | C8.1 85.85,42.93 85.85,40.13 C7.1 85.85,39.88 89.15,36.58 | 89.15,36.58 90.93,34.8 90.93,31.75 RJ45.SHIELD0 | 85.85,28.19 87.63,28.19 90.93,31.5 RJ45.SHIELD0 | 85.85,28.19 85.34,28.19 RJ45.GND 85.85,28.19 | 89.15,36.58 94.49,41.91 | 94.49,41.91 98.55,45.97 B3.2 | 94.49,41.91 94.49,55.63 | 79.76,56.64 69.6,56.64
  Bottom 0.305: 7.87,24.64 7.87,23.37 3.3,18.8 J0.1 | 7.87,24.64 7.87,33.53 USB.GND | LCD.5 27.94,65.53 26.42,67.06 19.56,67.06 18.03,65.53 LCD.1 17.78,65.53 P0.14 | 7.87,24.64 38.61,24.64 V1.1 | V6.1 58.93,14.48 68.58,14.48 V8.1 68.83,14.73 68.83,16.26 72.9,20.32 P4.3 72.9,20.57 68.83,24.64 V7.1 | v51.31,49.78 52.32,49.78 53.59,48.51 v55.88,48.51 | v69.6,60.2 v67.31,62.48 | J1.1 82.55,4.57 90.93,12.95 90.93,15.49 RJ45.SHIELD1
  pour Top (isolate 0.406, hatched): 0,80 100,80 100,0 0,0
  pour Bottom (isolate 0.406, hatched): 0,80 100,80 100,0 0,0
INT0  (via drill 0.3)
  Top 0.305: v47.75,48.77 49.02,48.77 IC4.11 | v46.48,47.5 42.93,43.94 42.93,41.66 43.69,40.89 43.69,37.34 42.42,36.07 38.1,36.07 v37.59,36.58 | v36.07,60.96 39.62,64.52 39.62,67.56 P0.4
  Bottom 0.305: v46.48,47.5 v47.75,48.77 | v37.59,36.58 37.59,40.39 36.07,41.91 v36.07,60.96
INT1  (via drill 0.3)
  Top 0.305: v49.78,43.69 51.05,44.96 51.05,46.99 IC4.12 | v56.13,35.31 56.13,30.73 55.88,30.48 55.88,28.19 v57.91,26.16
  Bottom 0.305: v49.78,43.69 54.61,38.86 54.61,36.83 v56.13,35.31 | v57.91,26.16 57.91,25.4 55.63,23.11 55.63,7.87 62.23,1.27 85.85,1.27 87.63,3.05 J1.2
INT2  (via drill 0.3)
  Top 0.305: v52.58,61.47 52.58,58.93 IC4.42
  Bottom 0.305: v52.58,61.47 49.53,64.52 49.53,67.31 P0.3
LEDA
  Top 0.305: REA.2 81.03,15.75 88.39,15.75 90.42,13.72 91.95,13.72 92.2,13.97 93.22,13.97 93.98,13.21 93.98,9.91 94.74,9.14 95.76,9.14 98.81,12.19 98.81,16.76 RJ45.G+
LEDB  (via drill 0.3)
  Top 0.305: v89.15,32 86.36,29.21 81.03,29.21 REB.2
  Bottom 0.305: v89.15,32 90.42,33.27 95.76,33.27 98.81,30.23 RJ45.Y+
MISO  (via drill 0.3)
  Top 0.305: v50.55,56.13 49.28,56.13 IC4.2 | v41.66,42.67 41.66,38.86 IC7.6 41.66,38.61 v41.66,36.83 | v41.91,45.72 41.91,46.23 43.43,47.75 ISP.1 | v79.25,52.83 79.25,54.36 U1.7 | v68.07,33.78 68.07,33.27 67.56,32.77 67.56,32.26 IC6.6 67.31,32 67.31,31.5 65.53,29.72 v64.01,29.72
  Bottom 0.305: v50.55,56.13 50.55,55.12 43.43,48.01 ISP.1 | v41.66,42.67 41.66,45.47 v41.91,45.72 | v79.25,52.83 79.25,51.05 74.93,46.74 74.17,46.74 68.07,40.64 v68.07,33.78 | v41.66,36.83 45.21,36.83 47.5,39.12 48.01,39.12 48.51,38.61 48.51,36.07 53.09,31.5 62.23,31.5 v64.01,29.72
MOSI  (via drill 0.3)
  Top 0.305: v47.5,56.64 47.75,56.9 49.02,56.9 IC4.1 | 43.94,51.56 v44.7,52.32 | 43.94,51.56 42.16,51.56 40.89,50.29 | 43.94,51.56 45.47,50.04 45.47,47.24 42.42,44.2 42.42,41.4 42.67,41.15 42.67,38.86 IC7.5 | v74.42,45.97 74.42,49.53 74.93,50.04 74.93,54.36 U1.3 | v69.09,33.78 69.09,32.51 68.83,32.26 IC6.7 68.58,32 68.58,31.5 66.04,28.96 v64.77,28.96 | 40.89,50.29 38.86,50.29 v33.02,44.45 | 40.89,50.29 ISP.4
  Bottom 0.305: v47.5,56.64 46.99,56.64 44.7,54.36 v44.7,52.32 | v74.42,45.97 74.42,42.67 69.09,37.34 v69.09,33.78 | v33.02,44.45 33.02,32.77 36.83,28.96 v64.77,28.96
N$1
  Top 0.61: IC1.1 14.99,31.75 12.7,31.75 6.1,25.15 D1.C 5.84,24.89 4.83,23.88 4.83,7.11 C1.+
N$2  (via drill 0.3)
  Top 0.61: 19.56,22.86 19.56,18.29 19.81,18.03 L1.2 | 19.56,22.86 19.56,28.45 20.07,28.96 20.07,31.75 IC1.4 20.32,32 20.32,32.77 v22.1,34.54 | v26.92,42.42 26.92,44.96 F1.1 | C2.+ 25.91,16.76 19.81,22.86 19.56,22.86
  Bottom 0.61: v26.92,42.42 26.92,39.37 v22.1,34.54
N$3  (via drill 0.3)
  Top 0.305: v46.74,27.94 46.74,29.21 RN1.1 | v33.53,23.37 32,24.89 T1.3 | 38.86,22.1 JP2.1
  Bottom 0.305: v46.74,27.94 44.7,27.94 40.13,23.37 | 40.13,23.37 38.86,22.1 JP2.1 | 40.13,23.37 v33.53,23.37
N$4
  Top 0.305: RN2.7 51.56,30.99 51.56,33.78 IC5.5
N$5
  Top 0.305: RN2.6 52.58,30.99 52.58,33.53 52.83,33.78 IC5.6
N$6
  Bottom 0.61: J2.2 2.03,54.1 2.03,53.09 4.06,51.05 4.06,42.93 1.52,40.39 1.52,15.24 3.05,13.72 J0.2
N$7
  Top 0.305: RN2.5 53.34,30.99 53.34,32.51 54.1,33.27 54.1,33.78 IC5.7
N$8
  Top 0.305: IC3.1 10.41,57.4 8.13,55.12 X2.2
N$9
  Top 0.61: IC1.2 17.02,31.75 17.02,27.18 D3.C 16.76,26.92 16.76,24.64 10.16,18.03 L1.1
N$10
  Top 0.305: RN2.8 50.55,30.99 50.55,33.78 IC5.4
N$11
  Top 0.305: RN1.5 49.28,30.99 49.28,33.78 IC5.3
N$12
  Top 0.305: RN1.6 48.26,30.99 48.26,33.53 48.01,33.78 IC5.2
N$13
  Top 0.305: RN1.7 47.5,30.99 47.5,32.26 46.74,33.02 46.74,33.78 IC5.1
N$14  (via drill 0.3)
  Top 0.305: v46.74,32 46.74,30.99 RN1.8 | v47.75,38.35 47.75,39.88 IC5.15
  Bottom 0.305: v46.74,32 46.74,37.34 v47.75,38.35
N$15  (via drill 0.3)
  Top 0.305: v47.5,27.43 47.5,29.21 RN1.2 | T2.3 32,14.99 34.8,12.19 38.61,12.19 JP3.1 38.86,11.94
  Bottom 0.305: v47.5,27.43 47.5,26.42 39.88,18.8 39.88,13.21 38.86,12.19 JP3.1
N$16
  Top 0.61: V1.2 38.61,19.3 34.54,19.3 34.29,19.05 T1.4
  Bottom 0.61: S12.1 32.51,3.3 32.51,13.21 38.61,19.3 V1.2
N$17
  Top 0.61: 37.59,9.4 34.54,9.4 34.29,9.14 T2.4 | 37.59,9.4 38.61,9.4 V2.2 | 37.59,9.4 37.59,3.3 S12.2
N$18
  Top 0.61: V3.2 48.51,19.3 44.7,19.3 44.45,19.05 T3.4
  Bottom 0.61: S34.1 42.67,3.3 42.67,13.46 48.51,19.3 V3.2
N$19
  Top 0.305: RN1.3 48.51,29.21 48.51,26.42 49.78,25.15 49.78,23.11 48.77,22.1 JP4.1 48.51,22.1 44.96,22.1 42.16,24.89 T3.3
N$20
  Top 0.61: 47.75,9.4 44.7,9.4 44.45,9.14 T4.4 | 47.75,9.4 48.51,9.4 V4.2 | 47.75,9.4 47.75,3.3 S34.2
N$21
  Top 0.305: RN1.4 49.28,29.21 49.28,26.42 50.29,25.4 50.29,13.72 48.77,12.19 JP5.1 | T4.3 42.16,14.99 43.18,13.97 43.18,13.72 44.7,12.19 48.51,12.19 JP5.1 | 48.77,11.94 JP5.1
N$22  (via drill 0.3)
  Top 0.61: V5.2 58.67,19.3 54.61,19.3 54.36,19.05 T5.4 54.36,18.8 v52.83,17.27
  Bottom 0.61: v52.83,17.27 52.83,3.3 S56.1
N$23
  Top 0.61: 57.91,9.4 54.61,9.4 54.36,9.14 T6.4 | 57.91,9.4 58.67,9.4 V6.2 | 57.91,9.4 57.91,3.3 S56.2
N$24
  Top 0.61: V7.2 68.58,19.3 64.52,19.3 64.26,19.05 T7.4
  Bottom 0.61: S78.1 57.15,8.89 57.15,14.73 61.72,19.3 68.58,19.3 V7.2
N$25
  Top 0.61: 68.07,9.4 64.52,9.4 64.26,9.14 T8.4 | 68.07,9.4 68.58,9.4 V8.2 | 68.07,9.4 68.07,3.3 S78.2
N$26
  Top 0.305: RN2.1 50.8,29.21 50.8,26.16 51.82,25.15 T5.3 52.07,24.89 54.86,22.1 58.67,22.1 JP6.1
N$27  (via drill 0.3)
  Top 0.305: 58.67,11.94 JP7.1 58.67,12.19 54.86,12.19 52.07,14.99 T6.3 51.82,15.24 v51.82,16.76 | v51.56,26.92 51.56,29.21 RN2.2
  Bottom 0.305: v51.56,26.92 51.56,17.02 v51.82,16.76
N$28  (via drill 0.3)
  Top 0.305: v53.59,27.18 52.58,28.19 52.58,29.21 RN2.3 | T7.3 61.98,24.89 64.77,22.1 68.58,22.1 JP8.1 68.83,22.1
  Bottom 0.305: v53.59,27.18 63.5,27.18 68.58,22.1 JP8.1
N$29
  Top 0.305: RN2.4 53.34,29.21 53.34,28.45 55.37,26.42 55.37,23.88 55.88,23.37 62.74,23.37 65.53,20.57 69.09,20.57 69.85,19.81 69.85,13.21 68.83,12.19 JP9.1 | T8.3 61.98,14.99 64.77,12.19 68.58,12.19 JP9.1 | 68.83,11.94 JP9.1
N$30
  Top 0.305: IC3.2 11.68,57.4 11.68,55.88 10.92,55.12 X2.1
N$34  (via drill 0.3)
  Top 0.305: v70.87,26.16 70.87,20.07 74.93,16 78.99,16 REA.1 | v62.48,40.39 62.48,41.66 IC6.27
  Bottom 0.305: v70.87,26.16 68.33,28.7 68.07,28.7 62.48,34.29 v62.48,40.39
N$36
  Top 0.305: IC3.3 13.21,57.4 13.21,56.64 14.22,55.63 20.83,55.63 BAT1.P$2
N$37  (via drill 0.3)
  Top 0.305: v78.99,30.73 78.99,29.21 REB.1 | v73.15,36.58 68.33,36.58 63.75,41.15 63.75,41.66 IC6.26
  Bottom 0.305: v73.15,36.58 v78.99,30.73
N$38  (via drill 0.3)
  Top 0.305: v31.5,33.78 34.8,33.78 RD+.2 | v13.97,32.77 11.18,35.56 11.18,36.83 10.41,37.59 9.4,37.59 8.13,36.32 USB.D+
  Bottom 0.305: v31.5,33.78 20.57,33.78 19.56,32.77 v13.97,32.77
N$39
  Top 0.305: CAP.1 61.21,29.21 61.21,32 IC6.1
N$41
  Top 0.305: X1.2 70.36,48.77 68.33,46.74 68.33,44.7 CX1.1 68.07,44.7 66.29,42.93 66.29,41.91 IC6.24
N$42  (via drill 0.3)
  Top 0.305: v72.39,45.97 72.39,44.7 CX2.1 | v67.56,43.18 67.56,41.91 IC6.23
  Bottom 0.305: X1.1 75.44,49.02 v72.39,45.97 69.6,43.18 v67.56,43.18
N$45  (via drill 0.3)
  Top 0.305: v35.05,32.51 35.05,31.24 RD-.2 | v35.05,39.37 35.05,38.1 RUSB.1
  Bottom 0.305: v35.05,32.51 v35.05,39.37 34.54,39.88 34.54,52.32 34.04,52.83 33.53,52.83 17.02,36.32 10.16,36.32 USB.D-
N$52  (via drill 0.3)
  Top 0.305: ISP.5 43.43,55.37 SJ1.1 | v38.35,33.02 38.86,32.51 38.86,31.24 IC7.1
  Bottom 0.305: v38.35,33.02 38.35,41.91 36.58,43.69 36.58,58.93 39.12,61.47 45.47,61.47 45.97,60.96 45.97,58.17 43.43,55.63 ISP.5
N$54
  Top 0.305: RN3.6 82.55,36.83 83.06,36.83 RN3.5 83.31,36.83 83.31,39.12 84.07,39.88 C7.2
N$59
  Top 0.305: RBS.2 76.96,29.21 76.96,30.99 77.47,31.5 77.47,32 IC6.14
QH*  (via drill 0.3)
  Top 0.305: v55.37,38.35 55.37,39.88 IC5.9 | v58.67,35.05 70.1,35.05 70.87,34.29 v70.87,34.04 | v77.98,30.73 78.74,31.5 v87.38,31.5
  Bottom 0.305: v58.67,35.05 v55.37,38.35 | v70.87,34.04 74.68,34.04 v77.98,30.73 | v87.38,31.5 97.03,21.84 97.03,5.33 95.76,4.06 93.98,4.06 92.96,5.08 EXTOUT.2
RD+  (via drill 0.3)
  Top 0.305: 82.55,32.77 83.06,33.27 83.06,35.05 RN3.4 | 82.55,32.77 78.99,32.77 78.23,33.53 77.22,33.53 76.45,32.77 76.45,32.26 IC6.13 | 82.55,32.77 v83.06,32.26
  Bottom 0.305: v83.06,32.26 86.36,28.96 86.36,23.62 87.63,22.35 87.63,21.84 RJ45.RD+
RD-  (via drill 0.3)
  Top 0.305: 81.79,34.04 81.28,33.53 78.99,33.53 78.49,34.04 76.45,34.04 75.18,32.77 75.18,32.26 IC6.12 | 81.79,34.04 82.3,34.54 82.3,35.05 RN3.3 | 81.79,34.04 v82.3,33.53
  Bottom 0.305: v82.3,33.53 82.3,28.96 85.09,26.16 85.09,25.65 RJ45.RD-
RESET  (via drill 0.3)
  Top 0.305: 44.45,56.9 44.45,56.64 44.96,56.13 44.96,55.63 SJ1.2 45.21,55.37 45.47,55.12 v45.47,54.1 | 44.45,56.9 44.45,58.17 RN4.3 | v47.5,54.61 49.02,54.61 IC4.4 | v57.4,30.73 57.4,34.8 58.42,35.81 58.93,35.81 59.18,35.56 70.36,35.56 72.39,33.53 72.39,32.26 IC6.10 | v35.31,47.75 39.12,51.56 41.4,51.56 42.16,52.32 42.16,56.13 42.93,56.9 44.45,56.9
  Bottom 0.305: v47.5,54.61 45.97,54.61 v45.47,54.1 | v57.4,30.73 57.15,30.73 56.9,30.99 39.37,30.99 35.81,34.54 35.81,41.4 35.31,41.91 v35.31,47.75
RXD  (via drill 0.3)
  Top 0.305: v53.59,52.83 51.31,50.55 49.28,50.55 IC4.9 | v59.18,55.37 v56.64,52.83
  Bottom 0.305: v56.64,52.83 v53.59,52.83 | v59.18,55.37 61.21,55.37 64.26,58.42 64.26,59.44 54.36,69.34 50.8,69.34 49.53,70.61 49.53,71.63 48.77,72.39 39.37,72.39 P0.6
SCK  (via drill 0.3)
  Top 0.305: v47.75,55.63 48.01,55.37 49.02,55.37 IC4.3 | v40.39,44.2 40.39,38.86 IC7.7 40.39,38.61 v40.39,36.83 | v41.15,46.23 42.16,47.24 42.16,49.02 43.43,50.29 ISP.3 | v78.23,43.18 78.23,49.53 77.22,50.55 77.22,54.36 U1.5 | IC6.8 69.85,32.26 v69.85,34.29 69.6,34.54 67.82,34.54 66.8,33.53 v60.2,33.53 | v53.59,35.81 v45.97,35.81
  Bottom 0.305: v47.75,55.63 48.26,55.12 48.26,54.36 44.45,50.55 43.43,50.55 ISP.3 | v40.39,44.2 40.39,45.47 v41.15,46.23 | v78.23,43.18 78.23,42.67 v69.85,34.29 | v40.39,36.83 41.4,35.81 v45.97,35.81 | v53.59,35.81 55.88,33.53 v60.2,33.53
SCL  (via drill 0.3)
  Top 0.305: 37.85,58.17 35.56,58.17 29.21,64.52 29.21,69.85 P0.10 26.67,72.39 15.49,72.39 9.65,66.55 9.65,62.48 10.16,61.98 12.19,61.98 12.95,62.74 12.95,63.5 IC3.6 | 37.85,58.17 42.67,58.17 RN4.1 | v56.64,45.47 56.64,46.99 IC4.19 | v47.24,42.93 v50.29,45.97 | 37.85,58.17 v37.85,58.42
  Bottom 0.305: v56.64,45.47 50.8,45.47 v50.29,45.97 | v47.24,42.93 44.45,42.93 41.91,40.39 41.4,40.39 37.59,44.2 37.59,58.17 v37.85,58.42
SDA  (via drill 0.3)
  Top 0.305: v35.31,57.4 43.18,57.4 43.43,57.66 43.43,58.17 RN4.2 | v57.4,50.04 57.4,47.24 IC4.20 | v61.21,59.18 63.75,61.72 63.75,65.79 56.13,73.41 37.59,73.41 v36.83,72.64 | v14.48,61.98 14.48,63.5 IC3.5
  Bottom 0.305: v35.31,57.4 35.31,58.42 31.75,61.98 | 31.75,61.98 29.21,64.52 29.21,67.31 25.65,70.87 | v57.4,50.04 57.4,55.37 v61.21,59.18 | v36.83,72.64 27.43,72.64 25.65,70.87 | 25.65,70.87 P0.11 | 31.75,61.98 v14.48,61.98
TCT  (via drill 0.3)
  Top 0.305: RN3.8 80.77,36.83 81.53,36.83 RN3.7 | 81.79,37.08 81.79,39.88 L2.1 82.04,40.13 84.07,42.16 84.07,42.93 C8.2 | 81.79,37.08 81.79,36.83 RN3.7 | 81.79,37.08 v79.76,37.08 | 81.79,37.08 RN3.7
  Bottom 0.305: v79.76,37.08 81.53,35.31 81.53,33.27 81.79,33.02 81.79,28.7 83.31,27.18 83.31,25.4 85.09,23.62 85.09,23.11 RJ45.P4
TD+  (via drill 0.3)
  Top 0.305: RN3.2 81.53,35.05 81.53,34.8 81.03,34.29 v80.26,34.29 75.18,39.37 75.18,41.66 IC6.17
  Bottom 0.305: v80.26,34.29 80.26,33.02 80.77,32.51 80.77,28.19 82.3,26.67 82.3,21.34 84.58,19.05 87.63,19.05 RJ45.TD+
TD-  (via drill 0.3)
  Top 0.305: RN3.1 80.52,35.31 v79.76,36.07 76.45,39.37 76.45,41.66 IC6.16
  Bottom 0.305: v79.76,36.07 81.03,34.8 81.03,33.02 81.28,32.77 81.28,28.45 82.8,26.92 82.8,23.37 85.09,21.08 85.09,20.57 RJ45.TD-
TXD  (via drill 0.3)
  Top 0.305: v46.99,49.78 49.02,49.78 IC4.10 | v44.7,47.5 44.7,47.24 42.42,44.96 40.13,44.96 v39.37,45.72 | v38.61,58.93 37.34,60.2 35.81,60.2 34.54,61.47 34.54,66.29 38.1,69.85 39.37,69.85 P0.5
  Bottom 0.305: v44.7,47.5 v46.99,49.78 | v39.37,45.72 39.37,46.74 38.1,48.01 38.1,57.66 38.61,58.17 v38.61,58.93
VCC  (via drill 0.3)
  Top 0.305: RN4.6 44.45,59.69 45.21,59.69 RN4.5 | RN4.5 45.47,59.69 46.74,58.42 46.74,54.36 47.24,53.85 49.02,53.85 IC4.5 | 57.15,71.12 61.72,66.55 61.72,66.04 60.2,64.52 60.2,62.23 RPR.2 | P2.1 57.15,71.12 | 57.15,71.12 57.15,62.23 C6.1 57.15,61.98 55.88,60.71 55.88,58.93 IC4.38 55.63,58.67 55.63,56.13 55.37,55.88 55.37,49.02 | v45.21,60.71 45.21,59.94 RN4.5 | v38.86,53.59 33.02,53.59 24.13,62.48 24.13,69.85 P0.12 | IC7.8 38.86,38.61 38.35,38.1 37.08,38.1 RUSB.2 36.83,37.85 36.07,37.08 | C3.+ 26.16,30.48 26.16,31.5 28.96,34.29 IC2.4 29.21,34.54 33.53,34.54 36.07,37.08 | C10.1 45.97,42.93 45.97,40.64 46.48,40.13 IC5.16 | 55.37,49.02 55.12,48.77 55.12,47.24 IC4.17 54.86,46.99 54.86,44.96 54.1,44.2 C4.1 54.1,43.94 54.1,40.13 IC5.10 54.1,39.88 54.1,38.61 53.09,37.59 47.5,37.59 46.74,38.35 46.74,39.12 | 55.37,49.02 58.42,52.07 60.71,52.07 IC4.27 | 46.74,39.12 46.74,39.88 IC5.16 | 36.07,37.08 37.59,35.56 43.18,35.56 46.74,39.12 | 46.74,39.12 IC5.16 | IC6.28 61.21,41.91 61.21,42.42 61.98,43.18 64.01,43.18 64.77,42.42 64.77,41.91 IC6.25 65.02,41.66 65.02,41.15 65.79,40.39 70.36,40.39 71.12,41.15 71.12,41.66 IC6.20 71.37,41.91 72.39,41.91 IC6.19 72.64,41.66 v72.64,39.88 | 79.76,40.13 79.25,40.13 77.72,41.66 IC6.15 77.47,41.91 77.47,49.53 76.2,50.8 76.2,54.36 U1.4 76.2,54.61 v76.2,55.88 | 79.76,40.13 80.01,40.13 L2.2 79.76,40.13 | 79.76,40.13 v79.76,38.1
  Bottom 0.305: P0.12 23.62,71.12 25.91,73.41 54.1,73.41 55.88,71.63 P2.1 55.88,70.36 62.23,64.01 68.07,64.01 v76.2,55.88 | v45.21,60.71 42.42,60.71 38.86,57.15 v38.86,53.59 | EXTOUT.1 95.5,5.33 95.5,6.35 96.52,7.37 96.52,21.34 v79.76,38.1 79.76,46.23 79.25,46.74 78.74,46.74 78.23,46.23 78.23,45.47 v72.64,39.88
VIN  (via drill 0.3)
  Top 0.61: IC3.8 10.67,63.75 10.67,64.52 11.18,65.02 11.18,66.04 C9.1 11.43,66.29 11.43,66.8 12.19,67.56 20.32,67.56 | P0.13 20.32,67.56 | 20.32,67.56 20.32,65.53 LCD.2 20.57,65.02 20.57,61.72 30.73,51.56 30.73,45.21 F1.2 | LCD.15 53.34,65.28 50.29,62.23 45.47,62.23 43.43,60.2 43.43,59.94 RN4.7 43.43,59.69 42.93,59.69 RN4.8 42.42,59.69 v41.91,59.18 | F1.2 31.24,44.96 33.02,43.18 35.05,43.18 D2.C 35.56,43.18 40.13,47.75 40.89,47.75 ISP.2 | F1.2 30.73,44.96 26.92,41.15 26.92,40.64 IC2.3 26.42,40.64 v25.4,39.62
  Bottom 0.61: P5.1 77.98,25.65 75.44,23.11 73.15,23.11 P4.2 72.9,23.11 71.88,23.11 48.51,46.48 42.42,46.48 42.04,46.86 | v25.4,39.62 19.56,33.78 10.16,33.78 USB.VBUS | 42.04,46.86 40.89,48.01 ISP.2 | v41.91,59.18 41.91,53.85 42.16,53.59 42.16,46.99 42.04,46.86

### Text on the board
tNames: OpenSprinkler v2.0 | www.opensprinkler.com | (Apr 2013) | GND VIN VCC SDA SCL A05 A06 A07 RXD TXD IN0 IN2 D14 D15 GND VCC | 24VAC | GND VIN A3 | GND A3 VIN | 1 | 2 | 3 | 4 | 5 | 6 | 7 | 8 | RAIN | EXTOUT
BoxDim: Serpac WM-032C Enclosure | All units are in inch | Left | Right | Front | Bottom